# EAGLE design ITC (EAGLE 6.4)
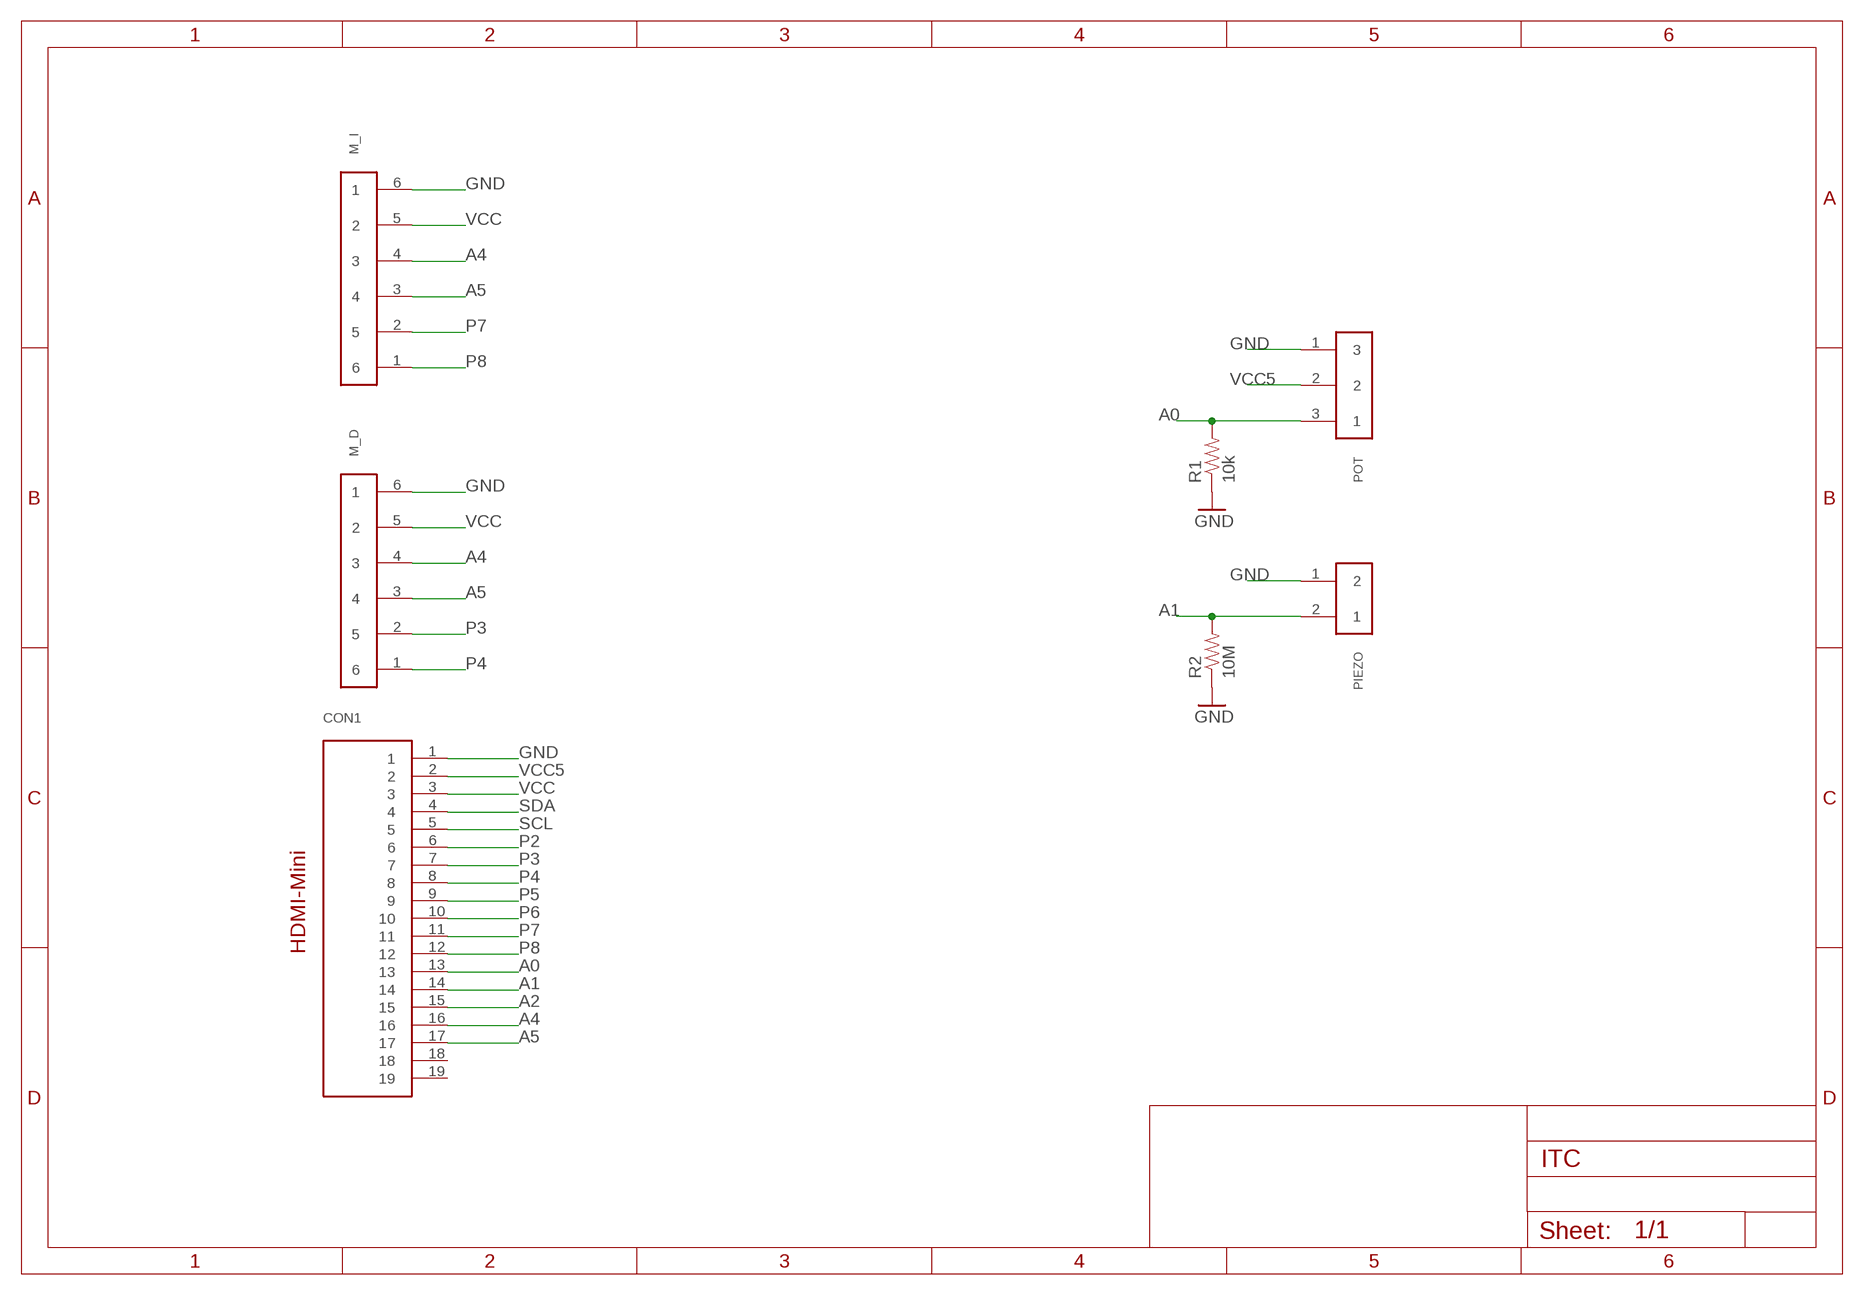
[diagram p0: schematic, sheet 1]

## Parts
CON1  HDMIMINI  [HDMIMINI]
M_D  653106131822  [653106131822]
M_I  653106131822  [653106131822]
PIEZO  653102131822  [653102131822]
POT  653103131822  [653103131822]
R1  10k  RESISTOR0402-RES  [0402-RES]
R2  10M  RESISTOR0402-RES  [0402-RES]

## Nets
A0: CON1.13 POT.3 R1.2
A1: CON1.14 PIEZO.2 R2.2
A2: CON1.15
A4: CON1.16 M_D.4 M_I.4
A5: CON1.17 M_D.3 M_I.3
GND: CON1.1 M_D.6 M_I.6 PIEZO.1 POT.1 R1.1 R2.1
P2: CON1.6
P3: CON1.7 M_D.2
P4: CON1.8 M_D.1
P5: CON1.9
P6: CON1.10
P7: CON1.11 M_I.2
P8: CON1.12 M_I.1
SCL: CON1.5
SDA: CON1.4
VCC: CON1.3 M_D.5 M_I.5
VCC5: CON1.2 POT.2
Unconnected: CON1.18 CON1.19

## Library data of the parts
CON1 = con-hdmi:HDMIMINI
M_D M_I = Wuerth_Elektronik_eiCan_09_Wire_to_Board_Connectors:653106131822: WR-WTB 1.25mm SMT Male Horizontal Shrouded Header, 6 Pins
PIEZO = Wuerth_Elektronik_eiCan_09_Wire_to_Board_Connectors:653102131822: WR-WTB 1.25mm SMT Male Horizontal Shrouded Header, 2 Pins
POT = Wuerth_Elektronik_eiCan_09_Wire_to_Board_Connectors:653103131822: WR-WTB 1.25mm SMT Male Horizontal Shrouded Header, 3 Pins
R1 R2 = SparkFun-Passives:RESISTOR: Resistor Basic schematic elements and footprints for 0603, 1206, and PTH resistors.

## Board
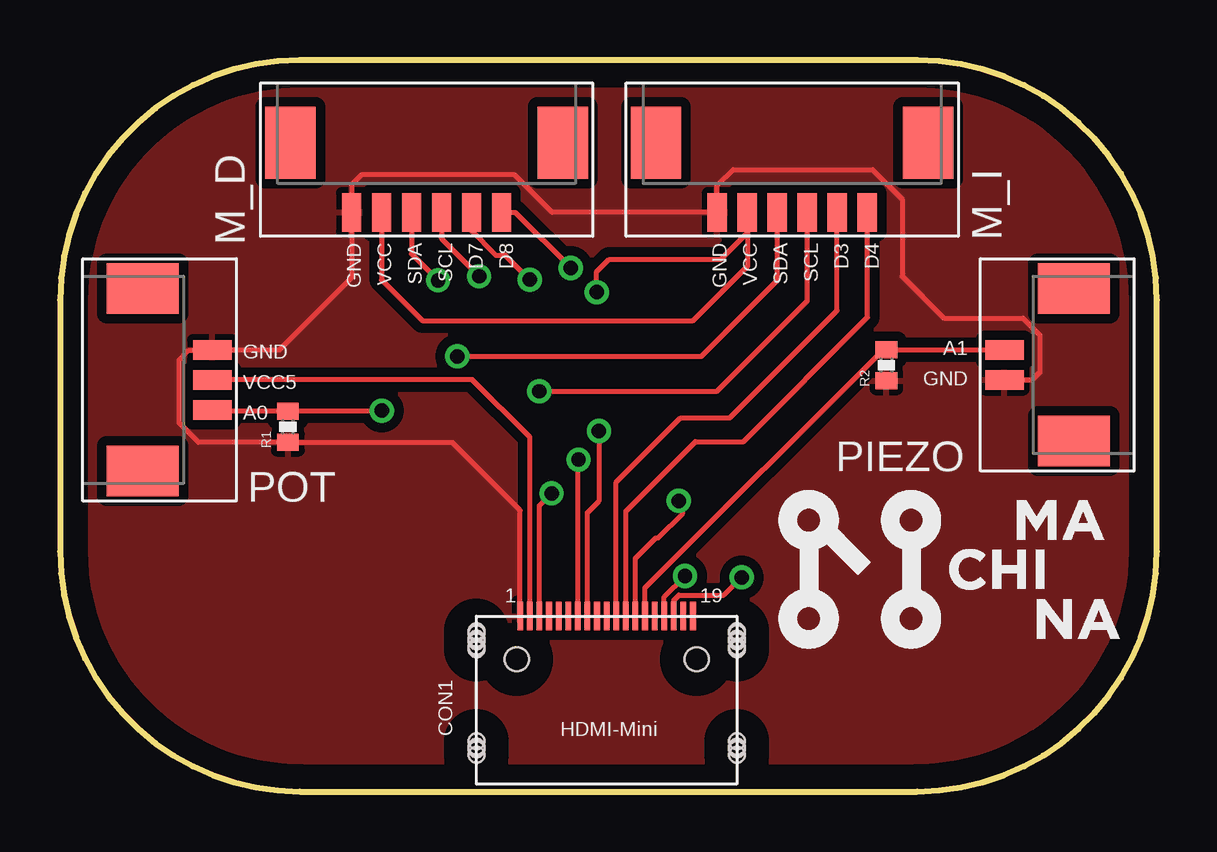
[diagram p1: board, top side]
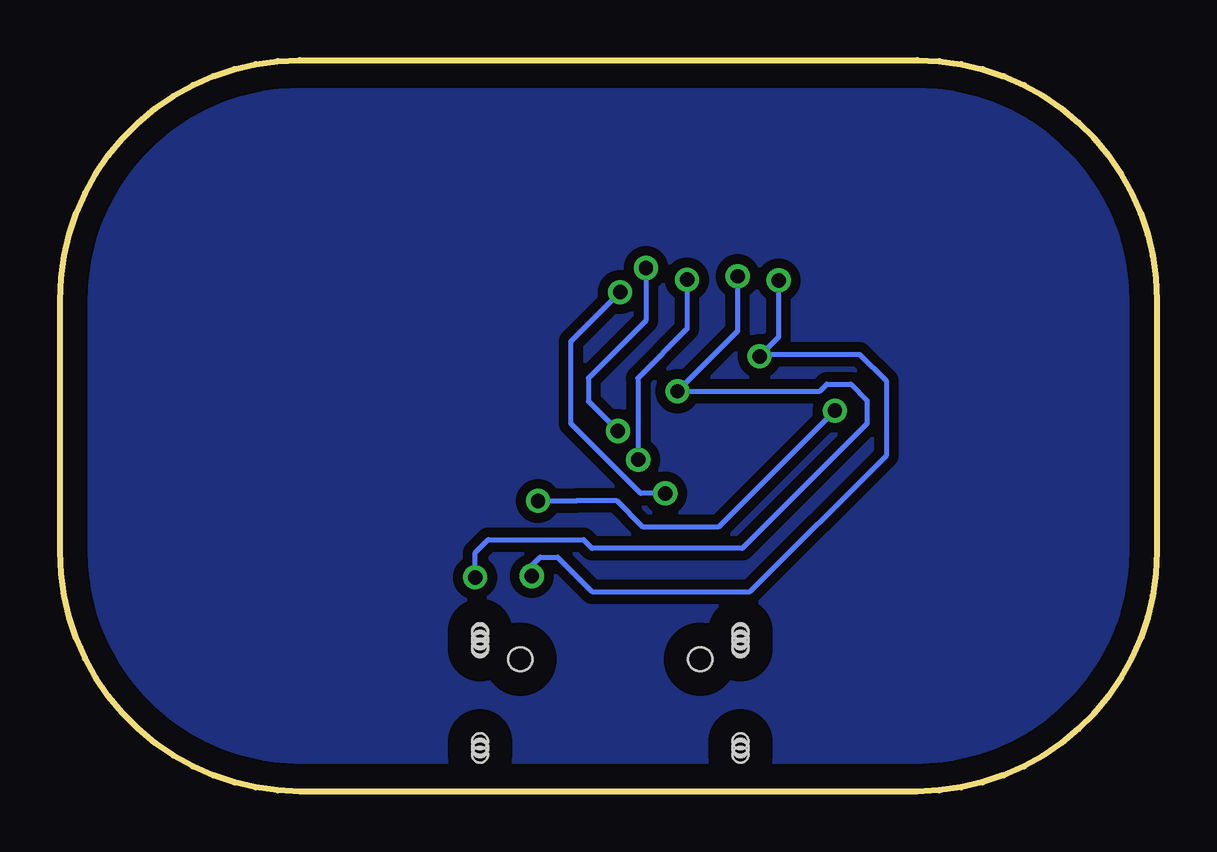
[diagram p2: board, bottom side, seen from below]

Size 45.72 x 30.48 mm. Coordinates in mm from the lower left corner, seen from the top.
Outline: 0,20.48 0,10 arc90 10,0 35.72,0 arc90 45.72,10 45.72,20.48 arc90 35.72,30.48 10,30.48 arc90 0,20.48
Copper layers (1*16): Top 0.035mm / dielectric 1.5mm / Bottom 0.035mm
Design rules "default": minimum track width 10mil, minimum drill 24mil, track to track 8mil, track to pad 8mil, pad to pad 8mil, via to via 8mil, smd to smd 8mil, copper to edge 40mil, drill to drill 8mil, minimum pad ring 10mil, minimum via ring 8mil, stop-mask expansion 4mil, vias tented up to drill 0mil, thermal gap 10mil
Holes 0.65 mm at 28.21,6.68 28.21,5.94 28.21,6.04 28.21,6.59 28.21,6.36 28.21,6.26 28.21,2.09 28.21,1.54 28.21,1.86 28.21,1.76 17.36,6.68 17.36,5.94 17.36,6.04 17.36,6.59 17.36,6.36 17.36,6.26 17.36,2.09 17.36,1.54 17.36,1.86 17.36,1.76

### Footprints (pad centres in the part's own frame; a part is rotated, then mirrored left to right if it is on the bottom)
HDMIMINI = smd 0.23 x 1.2: 1 -3.675,3.5; 2 -3.275,3.5; 3 -2.875,3.5; 4 -2.475,3.5; 5 -2.075,3.5; 6 -1.675,3.5; 7 -1.275,3.5; 8 -0.875,3.5; 9 -0.475,3.5; 10 -0.075,3.5; 11 0.325,3.5; 12 0.725,3.5; 13 1.125,3.5; 14 1.525,3.5; 15 1.925,3.5; 16 2.325,3.5; 17 2.725,3.5; 18 3.125,3.5; 19 3.525,3.5 | hole 1: -3.825,1.7; 3.675,1.7
653106131822 = smd 0.81 x 1.6: 1 -0.625,0; 2 0.625,0; 3 1.875,0; 4 3.125,0; 5 4.375,0; 6 5.625,0 | smd 2.1 x 3: Z1 -3.175,-2.9; Z2 8.175,-2.9
653102131822 = smd 0.81 x 1.6: 1 -0.625,0; 2 0.625,0 | smd 2.1 x 3: Z1 -3.175,-2.9; Z2 3.175,-2.9
653103131822 = smd 0.81 x 1.6: 1 -0.625,0; 2 0.625,0; 3 1.875,0 | smd 2.1 x 3: Z1 -3.175,-2.9; Z2 4.425,-2.9
0402-RES = smd 0.7 x 0.9: 1 -0.65,0; 2 0.65,0

### Placement (x,y rotation side)
CON1  22.86,3.81 0 top
M_D  17.78,24.13 180 top
M_I  33.02,24.13 180 top
PIEZO  39.37,17.78 90 top
POT  6.35,17.78 270 top
R1  9.5,15.2 90 top
R2  34.45,17.76 90 top

### Tracks (layer width: path | path; a pad name or v marks a point on that pad's centre or on a via)
A0  (via drill 0.6)
  Top 0.2: CON1.13 23.98,9.72 24.84,10.57 24.93,10.57 25.96,11.6 25.96,11.95 v25.79,12.11 | POT.3 6.38,15.87 9.48,15.87 | 9.48,15.87 R1.2 | 9.48,15.87 v13.42,15.87
  Bottom 0.2: v13.42,15.87 18.25,11.04 21.44,11.04 22.52,12.13 24.17,12.13 24.19,12.11 v25.79,12.11
A1
  Top 0.2: CON1.14 24.39,8.48 34.31,18.41 R2.2 PIEZO.2
  Top 0.406: R2.2
A4  (via drill 0.6)
  Top 0.2: M_D.4 14.65,22.41 v15.76,21.3 | v16.56,18.13 26.73,18.13 29.9,21.3 M_I.4 | CON1.16 25.18,8.11 v26.05,8.98
  Bottom 0.2: v15.76,21.3 15.76,18.93 16.48,18.22 | 16.48,18.22 v16.56,18.13 | 16.48,18.22 12.39,18.22 11.28,17.11 11.28,14 16.95,8.33 23.53,8.33 24.97,9.77 25.71,9.77 26.05,9.43 v26.05,8.98
A5  (via drill 0.6)
  Top 0.2: M_D.3 15.9,23.04 v17.47,21.47 | v19.98,16.68 27.39,16.68 31.15,20.44 M_I.3 | CON1.17 25.59,7.97 25.79,8.18 27.67,8.18 v28.41,8.92
  Bottom 0.2: v17.47,21.47 17.47,19.19 v19.98,16.68 14.05,16.68 13.75,16.98 12.76,16.98 12.08,16.29 12.08,15.33 17.28,10.13 23.54,10.13 23.9,10.49 27.87,10.49 28.41,9.95 v28.41,8.92
GND
  Top 0.2: PIEZO.1 39.39,17.14 40.52,17.14 40.85,17.47 40.85,19.02 40.14,19.73 36.84,19.73 35.11,21.46 35.11,24.68 33.87,25.91 28.05,25.91 27.39,25.26 M_I.6 20.51,24.13 18.95,25.69 12.57,25.69 12.15,25.27 M_D.6 12.15,21.4 9.14,18.39 6.37,18.39 POT.1 6.32,18.38 5.37,18.38 4.96,17.97 4.96,15.37 5.78,14.55 R1.1 16.35,14.55 19.18,11.71 CON1.1
  pour Top (isolate 0.406): 0,20.48 0,10 arc90 10,0 35.72,0 arc90 45.72,10 45.72,20.48 arc90 35.72,30.48 10,30.48 arc90
N$1
  pour Bottom (isolate 0.406): 0,20.48 0,10 arc90 10,0 35.72,0 arc90 45.72,10 45.72,20.48 arc90 35.72,30.48 10,30.48 arc90
P3  (via drill 0.6)
  Top 0.2: M_D.2 17.16,23.36 18.16,22.35 18.55,22.35 v19.58,21.33 | CON1.7 21.59,13.8 v21.61,13.83
  Bottom 0.2: v19.58,21.33 19.58,19.27 21.63,17.22 21.61,17.2 v21.61,13.83
P4  (via drill 0.6)
  Top 0.2: M_D.1 18.98,24.13 v21.29,21.82 | v22.46,15.03 22.46,12.1 21.98,11.62 CON1.8
  Bottom 0.2: v21.29,21.82 21.29,19.62 23.69,17.22 23.69,16.25 v22.46,15.03
P7
  Top 0.2: CON1.11 23.18,12.88 25.87,15.56 27.92,15.56 32.39,20.04 M_I.2
P8
  Top 0.2: CON1.12 23.59,11.68 26.48,14.58 28.49,14.58 33.67,19.75 33.67,24.11 M_I.1
VCC  (via drill 0.6)
  Top 0.2: M_D.5 13.4,21.32 15.11,19.62 26.39,19.62 28.67,21.9 28.67,23.31 | 28.67,23.31 28.67,24.1 M_I.5 | CON1.3 19.98,11.92 v20.49,12.42 | v22.37,20.81 22.37,21.66 22.89,22.18 27.54,22.18 28.67,23.31
  Bottom 0.2: v20.49,12.42 21.52,12.42 24.43,15.33 24.43,18.76 v22.37,20.81
VCC5
  Top 0.2: CON1.2 19.59,14.77 17.19,17.16 POT.2

### Text on the board
tPlace: GND | VCC | SDA | SCL | D7 | D8 | GND | VCC | SDA | SCL | D3 | D4 | A1 | GND | GND | VCC5 | A0 | 1 | 19